# EAGLE design ME433_Board (EAGLE 5.11)
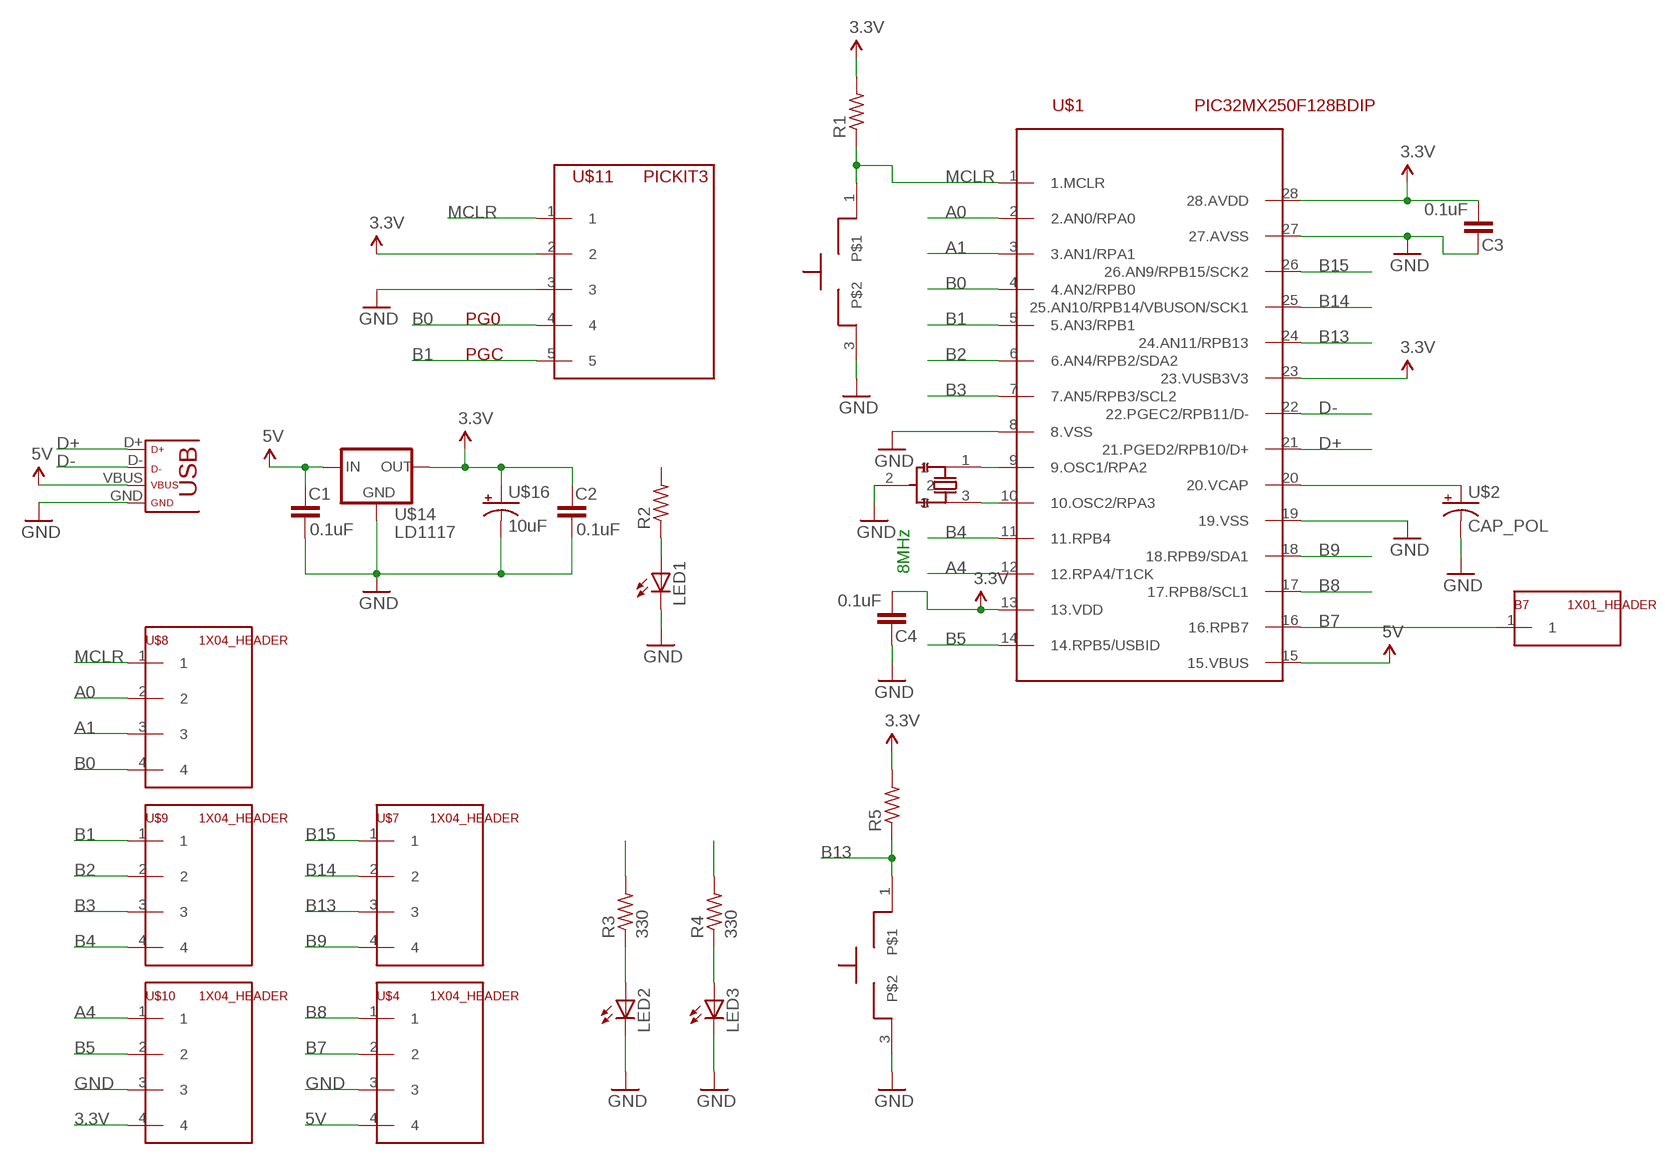
[diagram p0: schematic, sheet 1]

## Parts
B7  1X01_HEADER  [1X01]
C1  0.1uF  C-EU025-024X044  [C025-024X044]
C2  0.1uF  C-EU025-024X044  [C025-024X044]
C3  0.1uF  C-EU025-024X044  [C025-024X044]
C4  0.1uF  C-EU025-024X044  [C025-024X044]
LED1  LED3MM  [LED3MM]
LED2  LED3MM  [LED3MM]
LED3  LED3MM  [LED3MM]
R1  R-US_0309/12  [0309/12]
R2  R-US_0309/12  [0309/12]
R3  330  R-US_0309/12  [0309/12]
R4  330  R-US_0309/12  [0309/12]
R5  R-US_0309/12  [0309/12]
RESET  PUSH_BUTTON  [1X03]
U$1  PIC32MX250F128BDIP  [DIL28-3]
U$2  CAP_POL  [CAP_POL_D]
U$4  1X04_HEADER  [1X04]
U$5  PUSH_BUTTON  [1X03]
U$7  1X04_HEADER  [1X04]
U$8  1X04_HEADER  [1X04]
U$9  1X04_HEADER  [1X04]
U$10  1X04_HEADER  [1X04]
U$11  PICKIT3  [1X05]
U$12  USB  [USB-MINIB]
U$14  LD1117  [TO220]
U$16  10uF  CAP_POL  [CAP_POL_D]
U$17  RESONATOR_8MHZ  [1X03]

## Nets
3.3V: C2.2 C3.2 C4.2 R1.2 R5.2 U$1.13(13.VDD) U$1.23(23.VUSB3V3) U$1.28(28.AVDD) U$10.4 U$11.2 U$14.2(OUT) U$16.1(+)
5V: C1.2 U$1.15(15.VBUS) U$4.4 U$12.VBUS U$14.3(IN)
A0: U$1.2(2.AN0/RPA0) U$8.2
A1: U$1.3(3.AN1/RPA1) U$8.3
A4: U$1.12(12.RPA4/T1CK) U$10.1
B0: U$1.4(4.AN2/RPB0) U$8.4 U$11.4
B1: U$1.5(5.AN3/RPB1) U$9.1 U$11.5
B2: U$1.6(6.AN4/RPB2/SDA2) U$9.2
B3: U$1.7(7.AN5/RPB3/SCL2) U$9.3
B4: U$1.11(11.RPB4) U$9.4
B5: U$1.14(14.RPB5/USBID) U$10.2
B7: B7.1 U$1.16(16.RPB7) U$4.2
B8: U$1.17(17.RPB8/SCL1) U$4.1
B9: U$1.18(18.RPB9/SDA1) U$7.4
B13: R5.1 U$1.24(24.AN11/RPB13) U$5.1 U$7.3
B14: U$1.25(25.AN10/RPB14/VBUSON/SCK1) U$7.2
B15: U$1.26(26.AN9/RPB15/SCK2) U$7.1
D+: U$1.21(21.PGED2/RPB10/D+) U$12.D+
D-: U$1.22(22.PGEC2/RPB11/D-) U$12.D-
GND: C1.1 C2.1 C3.1 C4.1 LED1.K(C) LED2.K(C) LED3.K(C) RESET.3 U$1.8(8.VSS) U$1.19(19.VSS) U$1.27(27.AVSS) U$2.2(-) U$4.3 U$5.3 U$10.3 U$11.3 U$12.GND U$14.1(GND) U$16.2(-) U$17.2
MCLR: R1.1 RESET.1 U$1.1(1.MCLR) U$8.1 U$11.1
N$1: U$1.20(20.VCAP) U$2.1(+)
N$2: R3.2
N$4: R4.2
N$5: LED3.A R4.1
N$6: LED2.A R3.1
N$7: U$1.9(9.OSC1/RPA2) U$17.1
N$8: LED1.A R2.1
N$9: U$1.10(10.OSC2/RPA3) U$17.3
Unconnected: R2.2

## Notes on the sheet
- 8MHz

## Library data of the parts
B7 = ME433:1X01_HEADER
C1-C4 = ME433:C-EU: CAPACITOR, European symbol
LED1-LED3 = ME433:LED: LED OSRAM: - CHIPLED LG R971, LG N971, LY N971, LG Q971, LY Q971, LO R971, LY R971 LH N974, LH R974 LS Q976, LO Q976, LY Q976 LO Q996 - Hyper CHIPLED LW Q18S LB Q993, LB Q99A, LB R99A - SideLED LS A670, LO A670, LY A670, LG A670, LP A670 LB A673, LV A673, LT A673, LW A673 LH A674 LY A675 LS A676, LA A676, LO A676, LY A676, LW A676 LS A679, LY A679, LG A679 - Hyper Micro SIDELED® LS Y876, LA Y876, LO Y876, LY Y876 LT Y87S - SmartLED LW L88C, LW L88S LB L89C, LB L89S, LG L890 LS L89K, LO L89K, LY L89K LS L896, LA L896, LO L896, LY L896 - TOPLED LS T670, LO T670, LY T670, LG T670, LP T670 LSG T670, LSP T670, LSY T670, LOP T670, LYG T670 LG T671, LOG T671, LSG T671 LB T673, LV T673, LT T673, LW T673 LH T674 LS T676, LA T676, LO T676, LY T676, LB T676, LH T676, LSB T676, LW T676 LB T67C, LV T67C, LT T67C, LS T67K, LO T67K, LY T67K, LW E67C LS E67B, LA E67B, LO E67B, LY E67B, LB E67C, LV E67C, LT E67C LW T67C LS T679, LY T679, LG T679 LS T770, LO T770, LY T770, LG T770, LP T770 LB T773, LV T773, LT T773, LW T773 LH T774 LS E675, LA E675, LY E675, LS T675 LS T776, LA T776, LO T776, LY T776, LB T776 LHGB T686 LT T68C, LB T68C - Hyper Mini TOPLED® LB M676 - Mini TOPLED Santana® LG M470 LS M47K, LO M47K, LY M47K Source: http://www.osram.convergy.de LUXEON: - LUMILED® LXK2-PW12-R00, LXK2-PW12-S00, LXK2-PW14-U00, LXK2-PW14-V00 LXK2-PM12-R00, LXK2-PM12-S00, LXK2-PM14-U00 LXK2-PE12-Q00, LXK2-PE12-R00, LXK2-PE12-S00, LXK2-PE14-T00, LXK2-PE14-U00 LXK2-PB12-K00, LXK2-PB12-L00, LXK2-PB12-M00, LXK2-PB14-N00, LXK2-PB14-P00, LXK2-PB14-Q00 LXK2-PR12-L00, LXK2-PR12-M00, LXK2-PR14-Q00, LXK2-PR14-R00 LXK2-PD12-Q00, LXK2-PD12-R00, LXK2-PD12-S00 LXK2-PH12-R00, LXK2-PH12-S00 LXK2-PL12-P00, LXK2-PL12-Q00, LXK2-PL12-R00 Source: www.luxeon.com KINGBRIGHT: KA-3528ASYC Source: www.kingbright.com
R1-R5 = ME433:R-US_: RESISTOR, American symbol
RESET U$5 = ME433:PUSH_BUTTON
U$1 = ME433:PIC32MX250F128BDIP
U$2 U$16 = ME433:CAP_POL
U$4 U$7-U$10 = ME433:1X04_HEADER
U$11 = ME433:PICKIT3
U$12 = ME433:USB
U$14 = ME433:LD1117
U$17 = ME433:RESONATOR_8MHZ

## Board
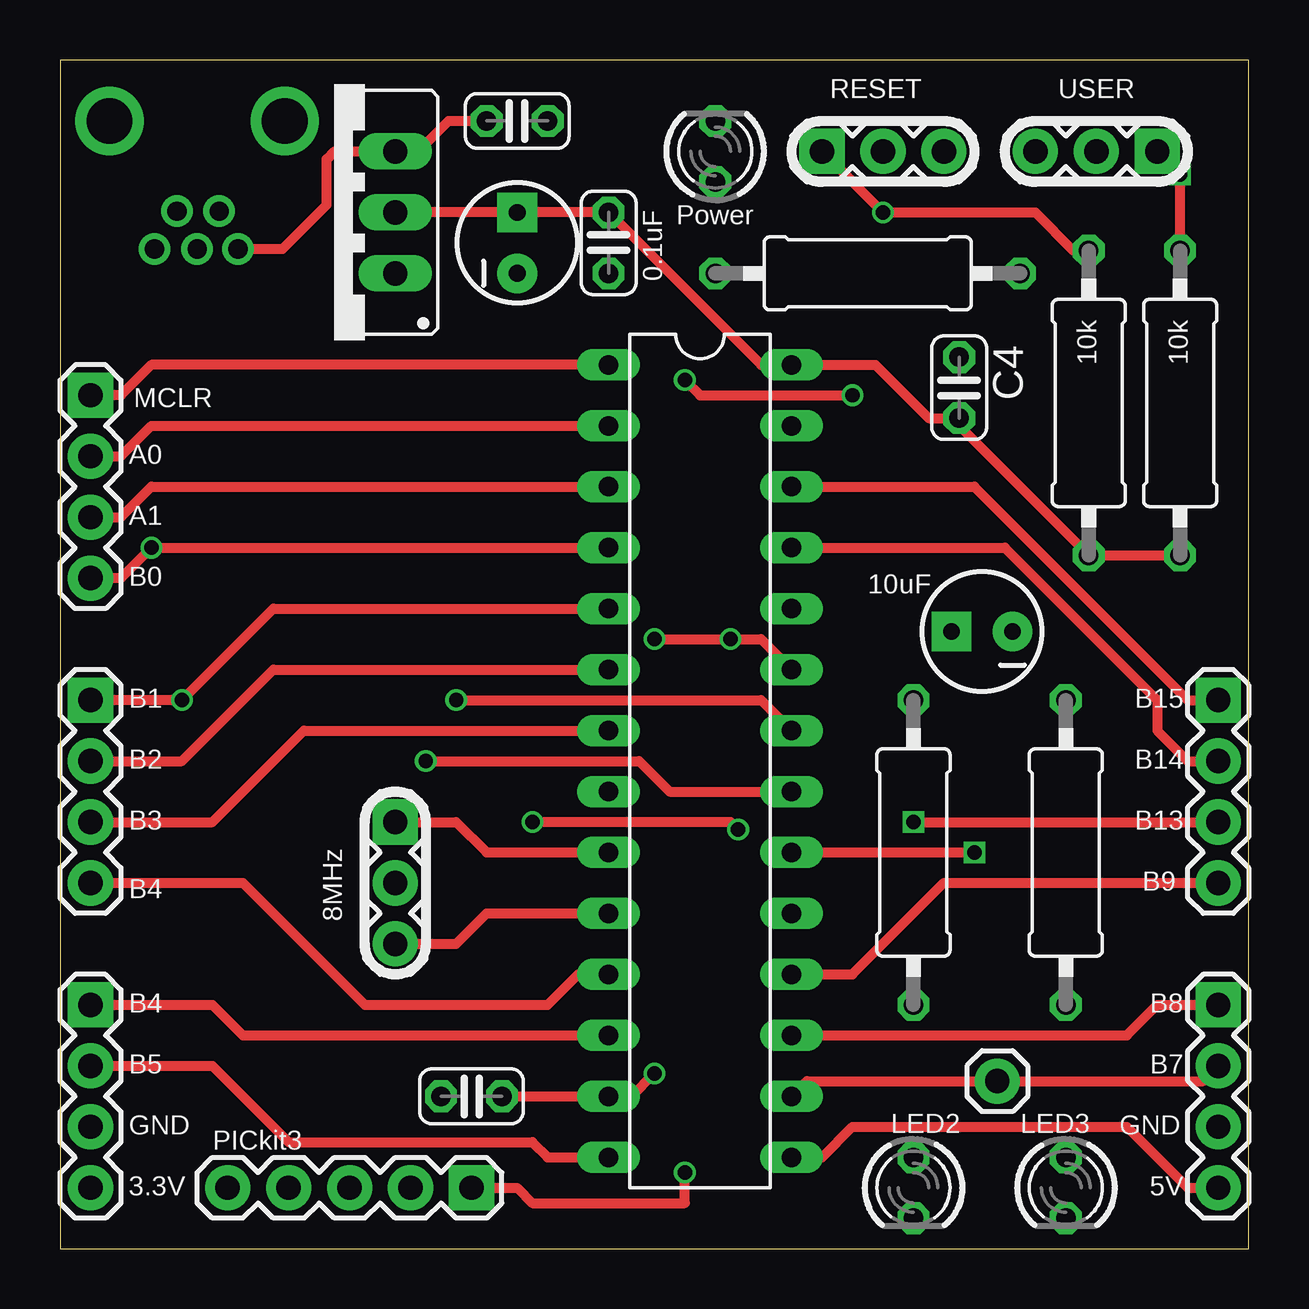
[diagram p1: board, top side]
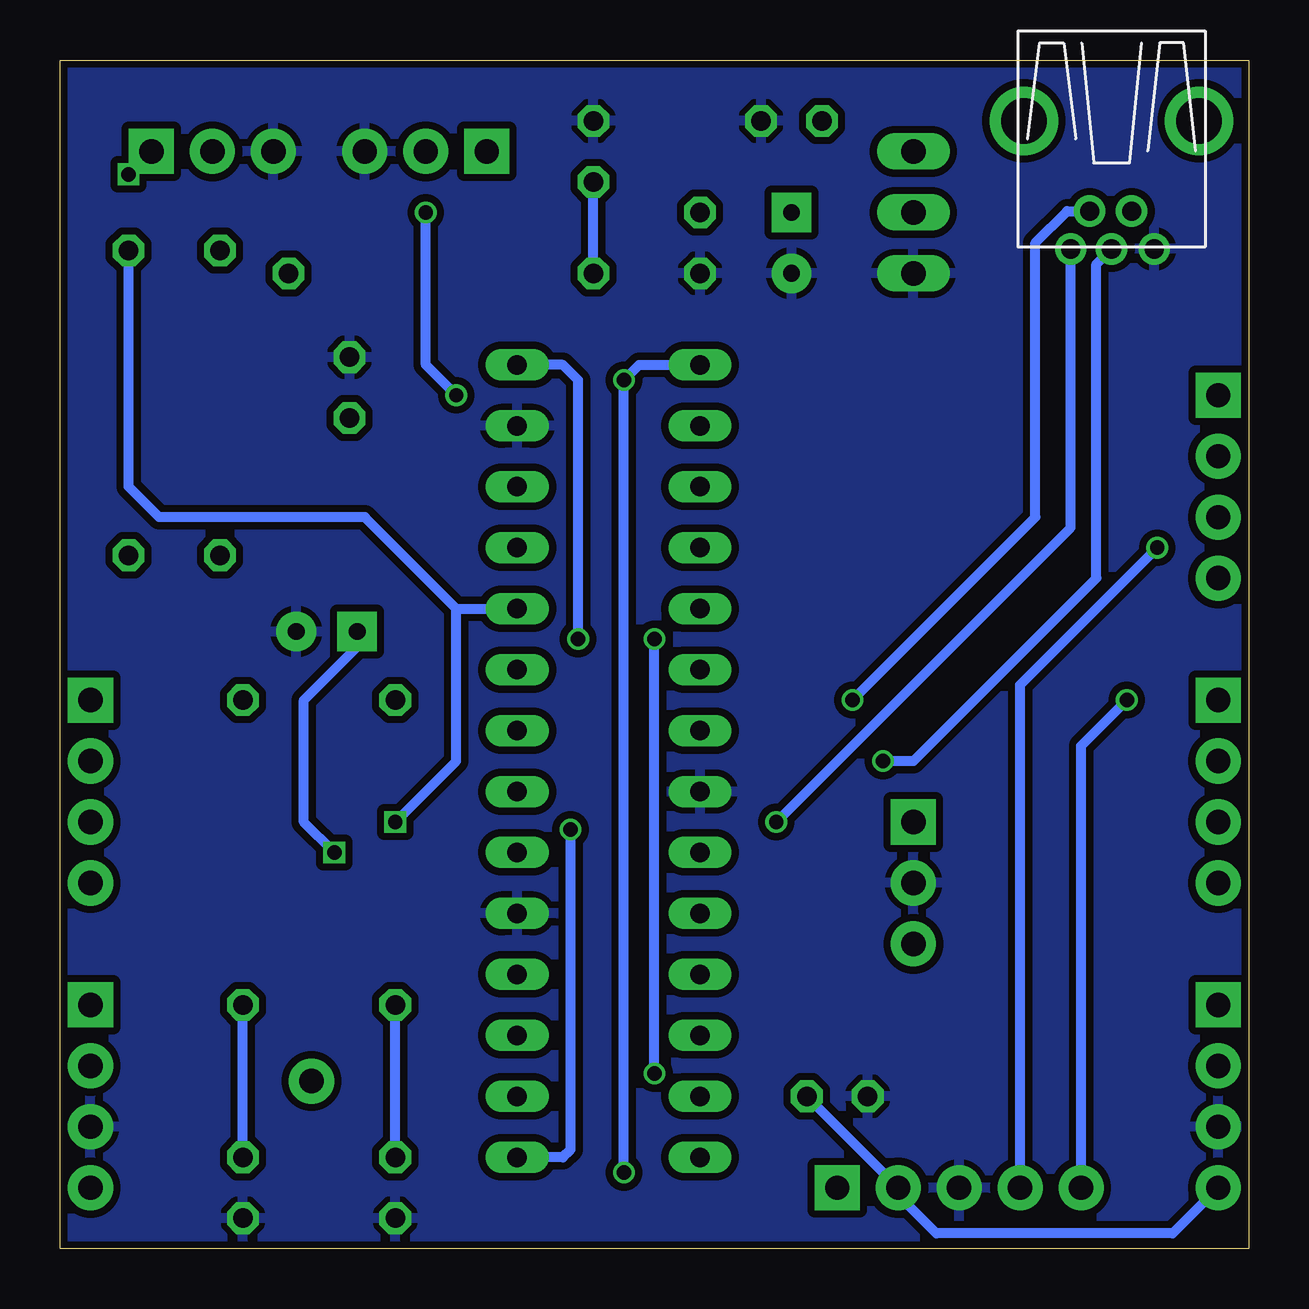
[diagram p2: board, bottom side, seen from below]

Size 49.53 x 49.53 mm. Coordinates in mm from the lower left corner, seen from the top.
Outline: 0,0 49.53,0 49.53,49.53 0,49.53 0,0
Copper layers (1*16): Top 0.035mm / dielectric 1.5mm / Bottom 0.035mm
Design rules "SeeedStudio_2layer_DRU_no_angle_20140221": minimum track width 6mil, minimum drill 12mil, track to track 6mil, track to pad 6mil, pad to pad 6mil, via to via 6mil, smd to smd 0mil, copper to edge 10mil, drill to drill 10mil, minimum pad ring 10mil, minimum via ring 6mil, stop-mask expansion 2mil, vias tented up to drill 100mil, thermal gap 10mil

### Footprints (pad centres in the part's own frame; a part is rotated, then mirrored left to right if it is on the bottom)
1X01 = drill 1.016 pad 1.88 round: 1 0,0
C025-024X044 = drill 0.813 octagon: 1 -1.27,0; 2 1.27,0
LED3MM = drill 0.813 octagon: A -1.27,0; K 1.27,0
0309/12 = drill 0.813 octagon: 1 -6.35,0; 2 6.35,0
1X03 = drill 1.016 pad 1.88 square: 1 0,0 | drill 1.016 pad 1.88 round: 2 2.54,0; 3 5.08,0
DIL28-3 = drill 0.813 long: 1 -16.51,-3.81; 2 -13.97,-3.81; 3 -11.43,-3.81; 4 -8.89,-3.81; 5 -6.35,-3.81; 6 -3.81,-3.81; 7 -1.27,-3.81; 8 1.27,-3.81; 9 3.81,-3.81; 10 6.35,-3.81; 11 8.89,-3.81; 12 11.43,-3.81; 13 13.97,-3.81; 14 16.51,-3.81; 15 16.51,3.81; 16 13.97,3.81; 17 11.43,3.81; 18 8.89,3.81; 19 6.35,3.81; 20 3.81,3.81; 21 1.27,3.81; 22 -1.27,3.81; 23 -3.81,3.81; 24 -6.35,3.81; 25 -8.89,3.81; 26 -11.43,3.81; 27 -13.97,3.81; 28 -16.51,3.81
CAP_POL_D = drill 0.7 pad 1.651 square: 1 1.27,0 | drill 0.7 pad 1.651 round: 2 -1.27,0
1X04 = drill 1.016 pad 1.88 square: 1 0,0 | drill 1.016 pad 1.88 round: 2 2.54,0; 3 5.08,0; 4 7.62,0
1X05 = drill 1.016 pad 1.88 square: 1 0,0 | drill 1.016 pad 1.88 round: 2 2.54,0; 3 5.08,0; 4 7.62,0; 5 10.16,0
USB-MINIB = drill 0.8 round: D+ 4.064,0; D- 2.489,0.914; GND 4.064,-1.778; ID 2.489,-0.838; VBUS 4.064,1.702 | drill 1.9 round: P$6 -1.27,-3.65; P$7 -1.27,3.65
TO220 = drill 1.016 long: 1 -2.54,0; 2 0,0; 3 2.54,0

### Placement (x,y rotation side)
B7  39.05,6.99 0 top
C1  19.05,46.99 180 top
C2  22.86,41.91 90 top
C3  17.14,6.35 0 top
C4  37.47,35.88 270 top
LED1  27.3,45.72 90 top
LED2  35.56,2.54 270 top
LED3  41.91,2.54 270 top
R1  42.86,35.24 270 top
R2  33.66,40.64 0 top
R3  35.56,16.51 90 top
R4  41.91,16.51 90 top
R5  46.67,35.24 270 top
RESET  31.75,45.72 0 top
U$1  26.67,20.32 270 top
U$2  38.42,25.72 180 top
U$4  48.26,10.16 270 top
U$5  45.72,45.72 180 top
U$7  48.26,22.86 270 top
U$8  1.27,35.56 270 top
U$9  1.27,22.86 270 top
U$10  1.27,10.16 270 top
U$11  17.14,2.54 180 top
U$12  5.71,45.72 270 top
U$14  13.97,43.18 90 top
U$16  19.05,41.91 90 top
U$17  13.97,17.78 270 top

### Tracks (layer width: path | path; a pad name or v marks a point on that pad's centre or on a via)
3.3V  (via drill 0.6)
  Top 0.406: C3.2 U$1.13 23.81,6.35 v24.77,7.3 | v24.77,25.4 v27.94,25.4 29.21,25.4 U$1.23 | U$14.2 U$16.1 C2.2 29.21,36.83 U$1.28 33.97,36.83 36.2,34.61 C4.2 37.47,34.29 R1.2 R5.2
  Bottom 0.406: C3.2 U$11.2 14.61,2.22 13.02,0.64 3.17,0.64 U$10.4 | v24.77,7.3 v24.77,25.4 | U$1.28 28.57,36.83 27.94,36.2 v27.94,25.4
5V  (via drill 0.6)
  Top 0.406: v28.26,17.46 27.94,17.78 v19.68,17.78 | U$12.VBUS 9.27,41.66 11.11,43.5 11.11,45.4 11.43,45.72 U$14.3 14.92,45.72 16.19,46.99 C1.2 | U$4.4 46.99,2.54 44.45,5.08 33.02,5.08 31.75,3.81 U$1.15
  Bottom 0.406: v28.26,17.46 28.26,4.13 28.57,3.81 U$1.15 | v19.68,17.78 7.42,30.05 U$12.VBUS
A0
  Top 0.406: U$8.2 2.54,33.02 3.81,34.29 U$1.2
A1
  Top 0.406: U$8.3 2.54,30.48 3.81,31.75 U$1.3
A4
  Top 0.406: U$10.1 6.35,10.16 7.62,8.89 U$1.12
B0  (via drill 0.6)
  Top 0.406: U$8.4 2.54,27.94 v3.81,29.21 U$1.4
  Bottom 0.406: U$11.4 9.53,23.5 v3.81,29.21
B1  (via drill 0.6)
  Top 0.406: U$9.1 v5.08,22.86 8.89,26.67 U$1.5
  Bottom 0.406: U$11.5 6.99,20.95 v5.08,22.86
B2
  Top 0.406: U$9.2 5.08,20.32 8.89,24.13 U$1.6
B3
  Top 0.406: U$9.3 6.35,17.78 10.16,21.59 U$1.7
B4
  Top 0.406: U$9.4 7.62,15.24 12.7,10.16 20.32,10.16 21.59,11.43 U$1.11
B5
  Top 0.406: U$10.2 6.35,7.62 9.53,4.45 19.68,4.45 20.32,3.81 U$1.14
B7
  Top 0.406: U$1.16 31.11,6.99 B7.1 47.62,6.99 U$4.2
B8
  Top 0.406: U$1.17 44.45,8.89 45.72,10.16 U$4.1
B9
  Top 0.406: U$1.18 33.02,11.43 36.83,15.24 U$7.4
B13  (via drill 0.6)
  Top 0.406: R5.1 v46.67,44.77 | v35.56,17.78 U$7.3
  Bottom 0.406: v46.67,44.77 U$5.1 | 33.02,26.67 36.83,30.48 45.4,30.48 46.67,31.75 R5.1 | 33.02,26.67 U$1.24 | v35.56,17.78 33.02,20.32 33.02,26.67
B14
  Top 0.406: U$1.25 39.37,29.21 45.72,22.86 45.72,21.59 46.99,20.32 U$7.2
B15
  Top 0.406: U$1.26 38.1,31.75 46.99,22.86 U$7.1
D+  (via drill 0.6)
  Top 0.406: v15.24,20.32 24.13,20.32 25.4,19.05 U$1.21
  Bottom 0.406: U$12.D+ 6.35,41.02 6.35,27.94 13.97,20.32 v15.24,20.32
D-  (via drill 0.6)
  Top 0.406: v16.51,22.86 29.21,22.86 U$1.22
  Bottom 0.406: U$12.D- 7.57,43.23 8.89,41.91 8.89,30.48 v16.51,22.86
GND
  pour Bottom (isolate 0.305): 0,49.53 0,0 49.53,0 49.53,49.53
MCLR  (via drill 0.6)
  Top 0.406: U$8.1 2.54,35.56 3.81,36.83 U$1.1 | v26.04,3.17 26.04,1.91 19.68,1.91 19.05,2.54 U$11.1 | RESET.1 v34.29,43.18 40.64,43.18 42.23,41.59 R1.1 | v26.04,36.2 26.67,35.56 v33.02,35.56
  Bottom 0.406: v26.04,3.17 v26.04,36.2 25.4,36.83 U$1.1 | v33.02,35.56 34.29,36.83 v34.29,43.18
N$1  (via drill 0.6)
  Top 0.406: U$1.20 v38.1,16.51
  Bottom 0.406: v38.1,16.51 39.37,17.78 39.37,22.86 37.15,25.08 U$2.1
N$5
  Bottom 0.406: LED3.A R4.1
N$6
  Bottom 0.406: LED2.A R3.1
N$7
  Top 0.406: U$17.1 16.51,17.78 17.78,16.51 U$1.9
N$8
  Bottom 0.406: R2.1 LED1.A
N$9
  Top 0.406: U$17.3 16.51,12.7 17.78,13.97 U$1.10

### Text on the board
tNames: RESET | USER | Power | 0.1uF | 10k | 10k | MCLR | A0 | A1 | B0 | 10uF | B1 | B15 | B2 | B14 | B3 | B13 | B4 | B9 | 8MHz | B4 | B8 | B5 | B7 | GND | GND | PICkit3 | 3.3V | 5V